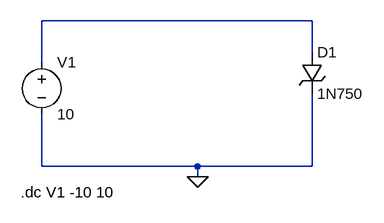
[diagram p0: schematic schemat_zenner.asc]
schemat_zenner.asc, the LTspice schematic file:
Version 4
SHEET 1 880 680
WIRE -224 -112 -640 -112
WIRE -224 -64 -224 -112
WIRE -640 -48 -640 -112
WIRE -640 112 -640 32
WIRE -400 112 -640 112
WIRE -224 112 -224 0
WIRE -224 112 -400 112
WIRE -400 128 -400 112
FLAG -400 128 0
SYMBOL voltage -640 -64 R0
WINDOW 123 24 124 Left 2
WINDOW 39 0 0 Left 0
SYMATTR InstName V1
SYMATTR Value 10
SYMBOL zener -240 -64 R0
SYMATTR InstName D1
SYMATTR Value 1N750
SYMATTR Description Diode
SYMATTR Type diode
TEXT -672 152 Left 2 !.dc V1 -10 10

The netlist it stands for:
* schemat_zenner.asc
V1 N001 0 10
D1 N001 0 1N750
.model D D
.lib standard.dio
.dc V1 -10 10
.backanno
.end